# EAGLE design Adafruit CAP1188 (EAGLE 6.3)
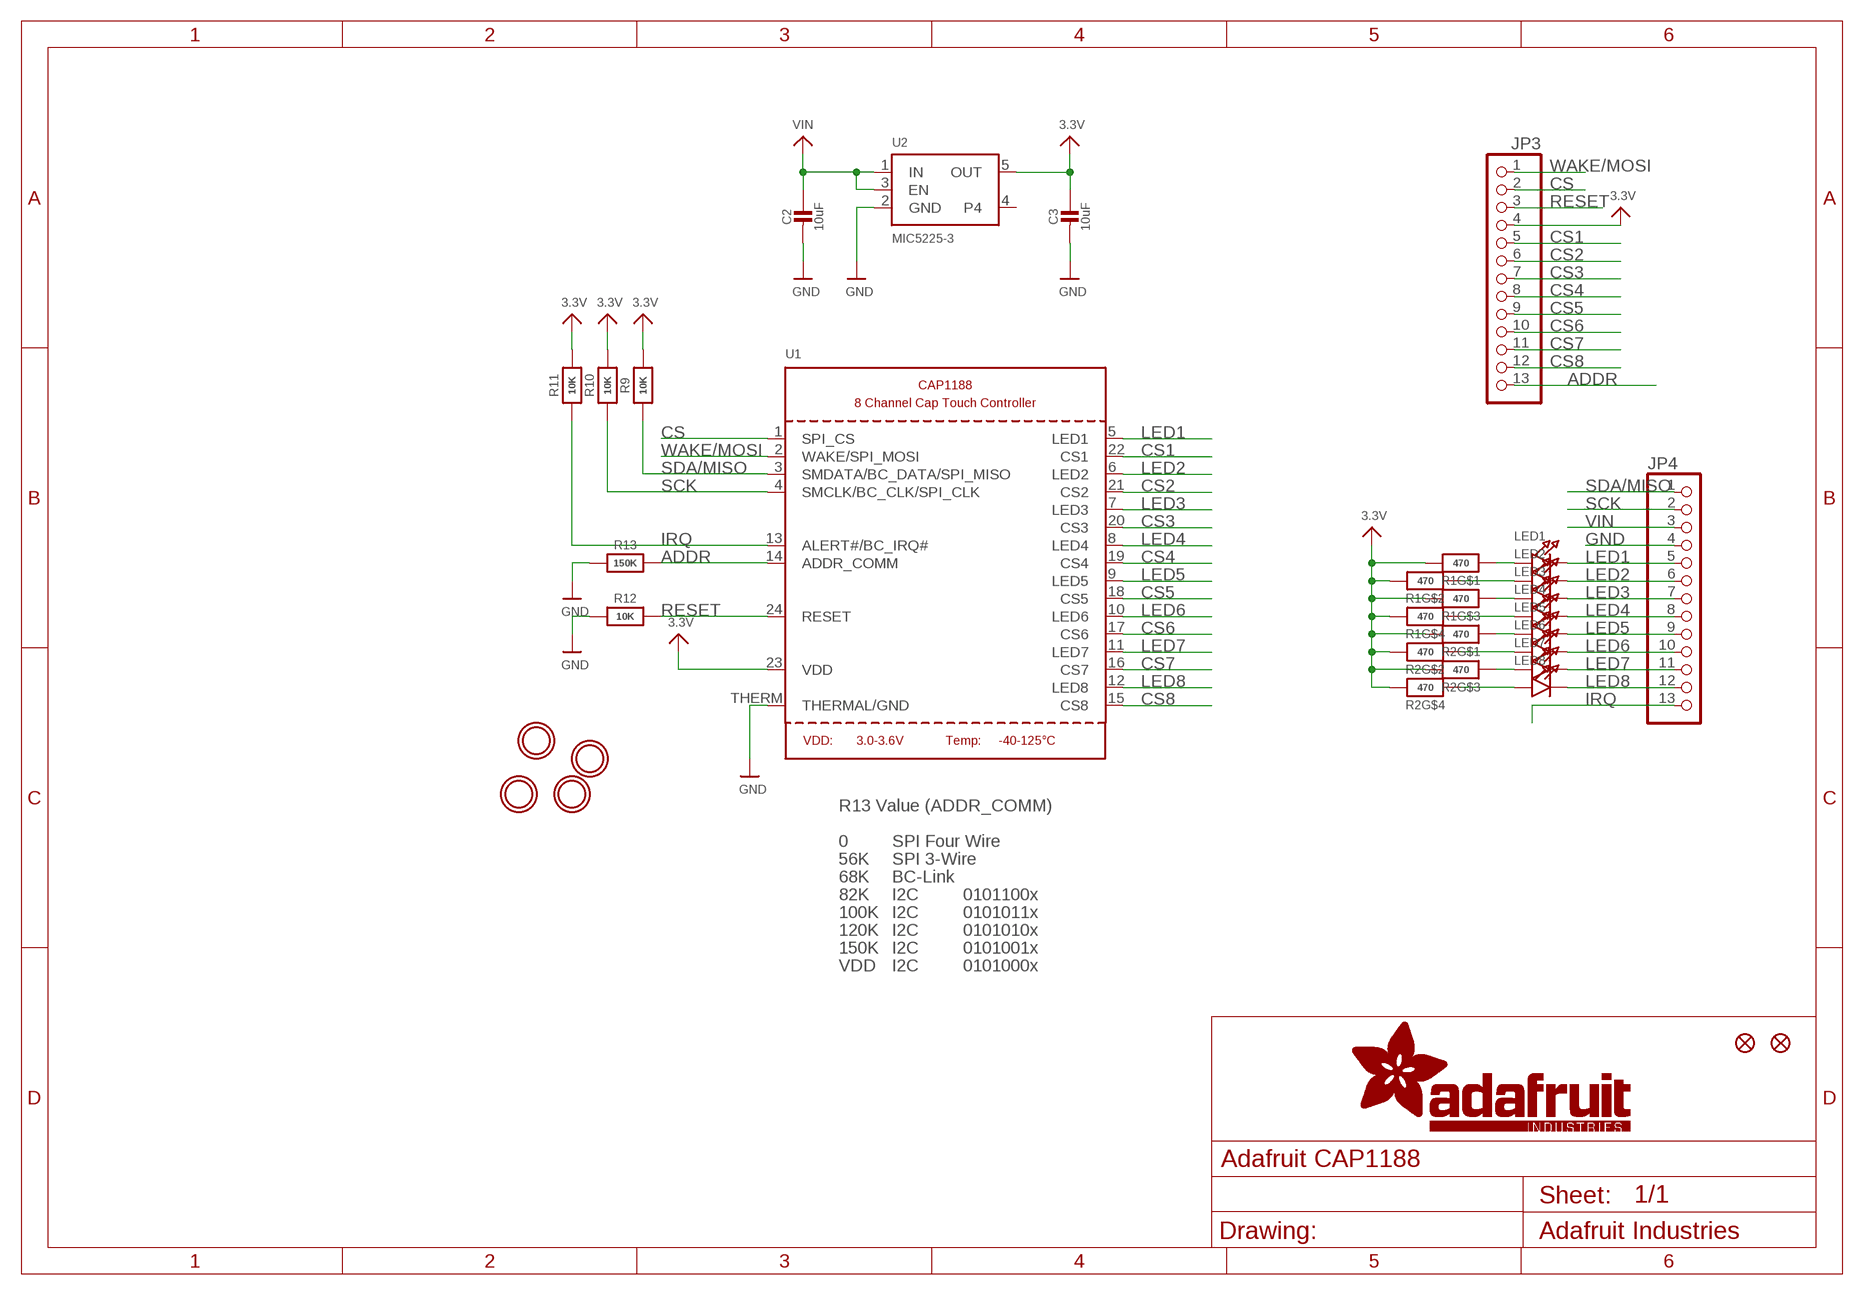
[diagram p0: schematic, sheet 1]

## Parts
C2  10uF  CAP_CERAMIC0805-NOOUTLINE  [0805-NO]
C3  10uF  CAP_CERAMIC0805-NOOUTLINE  [0805-NO]
FID1  FIDUCIAL""  [FIDUCIAL_1MM]
FID2  FIDUCIAL""  [FIDUCIAL_1MM]
JP3  HEADER-1X13  [1X13_ROUND_70]
JP4  HEADER-1X13  [1X13_ROUND_70]
LED1  LED0805  [CHIPLED_0805]
LED2  LED0805  [CHIPLED_0805]
LED3  LED0805  [CHIPLED_0805]
LED4  LED0805  [CHIPLED_0805]
LED5  LED0805  [CHIPLED_0805]
LED6  LED0805  [CHIPLED_0805]
LED7  LED0805  [CHIPLED_0805]
LED8  LED0805  [CHIPLED_0805]
R1  470  RESISTOR_4PACK  [RESPACK_4X0603]
R2  470  RESISTOR_4PACK  [RESPACK_4X0603]
R9  10K  RESISTOR0805_NOOUTLINE  [0805-NO]
R10  10K  RESISTOR0805_NOOUTLINE  [0805-NO]
R11  10K  RESISTOR0805_NOOUTLINE  [0805-NO]
R12  10K  RESISTOR0805_NOOUTLINE  [0805-NO]
R13  150K  RESISTOR_0805MP  [_0805MP]
U1  CAP1188  [QFN24_4MM_SMSC]
U2  MIC5225-3  VREG_SOT23-5  [SOT23-5]
U$7  MOUNTINGHOLE2.0  [MOUNTINGHOLE_2.0_PLATED]
U$8  MOUNTINGHOLE2.0  [MOUNTINGHOLE_2.0_PLATED]
U$9  MOUNTINGHOLE2.0  [MOUNTINGHOLE_2.0_PLATED]
U$10  MOUNTINGHOLE2.0  [MOUNTINGHOLE_2.0_PLATED]

## Nets
3.3V: C3.1 JP3.4 R1.5 R1.6 R1.7 R1.8 R2.5 R2.6 R2.7 R2.8 R9.2 R10.2 R11.2 U1.23(VDD) U2.5(OUT)
ADDR: JP3.13 R13.2 U1.14(ADDR_COMM)
CS: JP3.2 U1.1(SPI_CS)
CS1: JP3.5 U1.22(CS1)
CS2: JP3.6 U1.21(CS2)
CS3: JP3.7 U1.20(CS3)
CS4: JP3.8 U1.19(CS4)
CS5: JP3.9 U1.18(CS5)
CS6: JP3.10 U1.17(CS6)
CS7: JP3.11 U1.16(CS7)
CS8: JP3.12 U1.15(CS8)
GND: C2.2 C3.2 JP4.4 R12.1 R13.1 U1.THERM(THERMAL/GND) U2.2(GND)
IRQ: JP4.13 R11.1 U1.13(ALERT#/BC_IRQ#)
LED1: JP4.5 LED1.C U1.5(LED1)
LED2: JP4.6 LED2.C U1.6(LED2)
LED3: JP4.7 LED3.C U1.7(LED3)
LED4: JP4.8 LED4.C U1.8(LED4)
LED5: JP4.9 LED5.C U1.9(LED5)
LED6: JP4.10 LED6.C U1.10(LED6)
LED7: JP4.11 LED7.C U1.11(LED7)
LED8: JP4.12 LED8.C U1.12(LED8)
N$1: LED1.A R1.1
N$2: LED2.A R1.2
N$3: LED3.A R1.3
N$4: LED4.A R1.4
N$5: LED5.A R2.1
N$6: LED6.A R2.2
N$7: LED7.A R2.3
N$8: LED8.A R2.4
RESET: JP3.3 R12.2 U1.24(RESET)
SCK: JP4.2 R10.1 U1.4(SMCLK/BC_CLK/SPI_CLK)
SDA/MISO: JP4.1 R9.1 U1.3(SMDATA/BC_DATA/SPI_MISO)
VIN: C2.1 JP4.3 U2.1(IN) U2.3(EN)
WAKE/MOSI: JP3.1 U1.2(WAKE/SPI_MOSI)
Unconnected: U2.4

## Notes on the sheet
- R13 Value (ADDR_COMM)
- 0 | SPI Four Wire
- 56K | SPI 3-Wire
- 68K | BC-Link
- 82K | I2C | 0101100x
- 100K | I2C | 0101011x
- 120K | I2C | 0101010x
- 150K | I2C | 0101001x
- VDD | I2C | 0101000x

## Library data of the parts
C2 C3 = microbuilder:CAP_CERAMIC: Ceramic Capacitors For new designs, use the packages preceded by an '_' character since they are more reliable: The following footprints should be used on most boards: _0402 - Standard footprint for regular board layouts _0603 - Standard footprint for regular board layouts _0805 - Standard footprint for regular board layouts _1206 - Standard footprint for regular board layouts For extremely tight-pitch boards where space is at a premium, the following 'micro-pitch' footprints can be used (smaller pads, no silkscreen outline, etc.): _0402MP - Micro-pitch footprint for very dense/compact boards _0603MP - Micro-pitch footprint for very dense/compact boards _0805MP - Micro-pitch footprint for very dense/compact boards _1206MP - Micro-pitch footprint for very dense/compact boards
FID1 FID2 = microbuilder:FIDUCIAL: Fiducial Alignment Points Various fiducial points for machine vision alignment.; BOM: EXCLUDE
JP3 JP4 = microbuilder:HEADER-1X13
LED1-LED8 = microbuilder:LED: LED 0603 - 0603 Surface Mount Package 2mA: Green LED - Low Power (3.9mcd, 2ma, 1.7Vf) - Digikey: 475-2709-2-ND Orange LED - Low Power (9.8mcd, 2ma, 1.8Vf) - Digikey: 475-1194-2-ND Red LED - Low Power (5mcd, 2ma, 1.8Vf) - Digikey: 475-1195-2-ND Yellow LED - Low Power (7mcd, 2ma, 1.8Vf) - Digikey: 475-1196-2-ND 5mA: Blue LED - Low Power (17mcd, 5ma, 2.9Vf) - Digikey: LNJ937W8CRACT-ND 0805 - 0805 Surface Mount Package 2mA: Red LED (8.8mcd, 2mA, 1.8Vf, Clear) - Low Power [Digikey: 475-2510-1-ND] Green LED (5mcd, 2mA, 1.8Vf, Clear) - Low Power [Digikey: 475-2730-1-ND] Yellow LED (11.3mcd, 2mA, 1.8Vf, Clear) - Low Power [Digikey: 475-2555-1-ND] 20mA: Red LED (104mcd, 20mA, Diffused) - LS R976 [Digikey: 475-1278-6-ND] Red LED (12mcd, 20mA, 2.0Vf, Clear) - APT2012EC [Digikey: 754-1128-1-ND] Green LED (15mcd, 20mA, 2.2Vf, Clear) - APT2012GC [Digikey: 754-1131-1-ND] Orange LED (160mcd, 20mA, 2.1Vf, Clear) - APT2012SECK [Digikey: 754-1130-1-ND] 1206 - 1206 Surface Mount Package Green LED (26mcd, 20mA, Diffused) - LG N971 [Digikey: 475-1407-6-ND] Red LED (15mcd, 20mA, Diffused) - LH N974 [Digikey: 475-1416-6-ND] Cree - Cree High-Power Surface Mount LEDs XPEBWT-L1-0000-00D50 - White 111lm 350mA 2.9Vf 6200K 110° XTEAWT-00-0000-00000LEE3 - White 114lm 350mA 2.85Vf 5000K 115° Everlight - Everlight 45-21 Series Surface Mount LEDs 45-21/QK2C-B2832AC2CB2/2T - Warm White 2000mcd 20mA 3.25Vf 3050K 120° 45-21/LK2C-B38452C4CB2/2T - Nuetral White 2000mcd 20mA 3.25Vf 4150K 120° 45-21/LK2C-B50634C6CB2/2T - Cold White 2200mcd 20mA 3.25Vf 5650K 120° PLCC2 Reverse Mount LS T77K-J1L2-1-0-2-R18-Z - Red 11.25mcd 2mA 1.8Vf 630nm 120° LO T77K-L1M2-24-Z - Orange 19.6mcd 2mA 1.8Vf 606nm 120° LY T77K-K2M1-26-Z - Yellow 15.7mcd 2mA 1.8Vf 587nm 120°
R1 R2 = microbuilder:RESISTOR_4PACK: Resistor Packs (4 resistors) 4 x 0603 10K 1/16W - Digikey: YC164J-10KCT-ND
R9-R13 = microbuilder:RESISTOR: Resistors For new designs, use the packages preceded by an '_' character since they are more reliable: The following footprints should be used on most boards: _0402 - Standard footprint for regular board layouts _0603 - Standard footprint for regular board layouts _0805 - Standard footprint for regular board layouts _1206 - Standard footprint for regular board layouts For extremely tight-pitch boards where space is at a premium, the following 'micro-pitch' footprints can be used (smaller pads, no silkscreen outline, etc.): _0402MP - Micro-pitch footprint for very dense/compact boards _0603MP - Micro-pitch footprint for very dense/compact boards _0805MP - Micro-pitch footprint for very dense/compact boards _1206MP - Micro-pitch footprint for very dense/compact boards
U1 = microbuilder:CAP1188: CAP1188 - Eight Channel Cap Touch Controller
U2 = microbuilder:VREG_SOT23-5: SOT23-5 Fixed Voltage Regulators Part Current Out V Out V In V Dropout θJA (°C/W) TJ (°C) Digikey Part No. ADP121 150mA 3.3V 3.4-5.5V 0.09V @ 150mA -- -- ADP121-AUJZ33R7CT-ND ADP121 150mA 3.0V 3.1-5.5V 0.09V @ 150mA -- -- ADP121-AUJZ30R7CT-ND ADP122 300mA 3.3V 3.4-5.5V 0.085V @ 300mA -- -- ADP122AUJZ-3.3-R7CT-ND ADP1712 300mA 3.3V 3.5-5.5V 0.17V @ 300mA -- -- ADP1712AUJZ-3.3-R7TR-ND AP7311 (Low Cost) 150mA 3.3V 3.5-6V 0.15V @ 150mA -- -- AP7311-33WG-7DICT-ND LD39015M18R 150mA 1.8V 1.9V-5.5V 0.08V @ 100mA -- -- 497-6977-1-ND LP2985A-33DBVR 150mA 3.3V 3.3-16V 0.28V @ 150mA 206 150 296-18479-1-ND MCP1824T-3302E/OT 300mA 3.3V 3.5V-6V 0.2V @ 300mA -- -- MCP1824T-3302E/OTCT-ND MIC5205-2.5YM5 TR 150mA 2.5V 2.7-16V 0.165V @ 150mA -- -- 576-1257-2-ND MIC5205-3.0YM5 TR 150mA 3.0V 3.2V-16V 0.165V @ 150mA -- -- 576-1258-2-ND MIC5205-3.3YM5 TR 150mA 3.3V 3.5V-16V 0.165V @ 150mA -- -- 576-1259-2-ND TPS780330220 150mA 3.3V+2.2V 3.6-5.5V 250mV Max -- -- 296-23332-1-ND TDA3663/N1,135 100mA 3.3V 3.5-45V 0.18V @ 50mA -- -- 568-5343-1-ND Max operating temp can be calculated using θJA, TJ (max junction temperature), and power in watts. Set the "Maximum Ambient Temperature" until it reaches TJ ("Max Junction Temperature"), which is the absolute limit for safe use of the regulator: Heat Sink Temperature Calculator <http://www.daycounter.com/Calculators/Heat-Sink-Temperature-Calculator.phtml> For example, With 12V source into a 3.3V LP2985 and a 30mA load, we are dissipating (12V-3.3V) * 0.03A = 0.261W. With a θJA of 206 °C/W, a TJ of 150°C, and 261mW we can safely use the chip without a heat sink up to 75°C (=147.1°C Junction Temperature).
U$7-U$10 = microbuilder:MOUNTINGHOLE: Mounting Hole For #2 screws (0.086"/2.18mm width, 0.094"/2.4mm hole) use 2.5mm; BOM: EXCLUDE

## Board
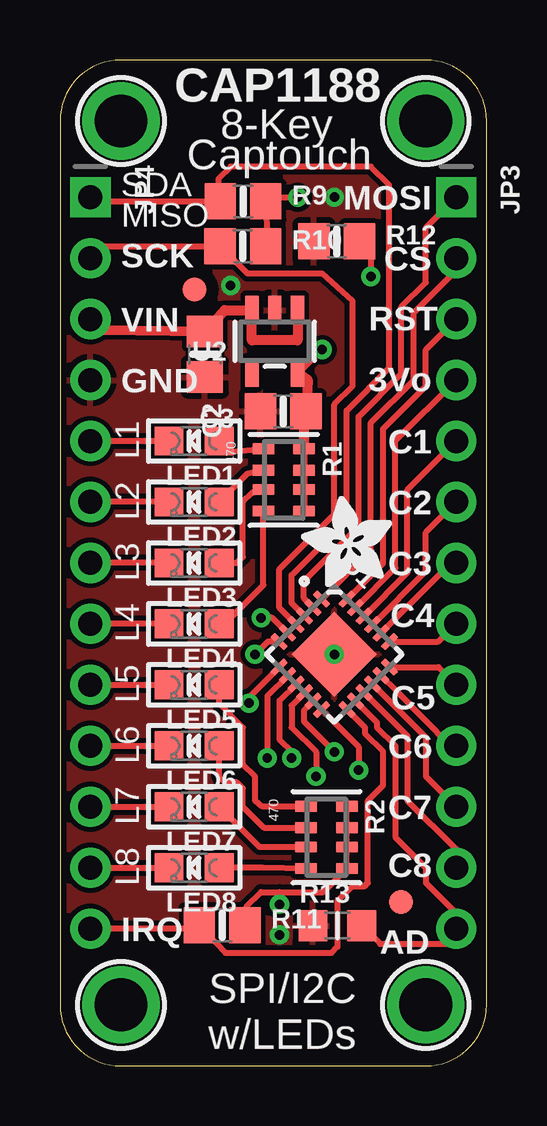
[diagram p1: board, top side]
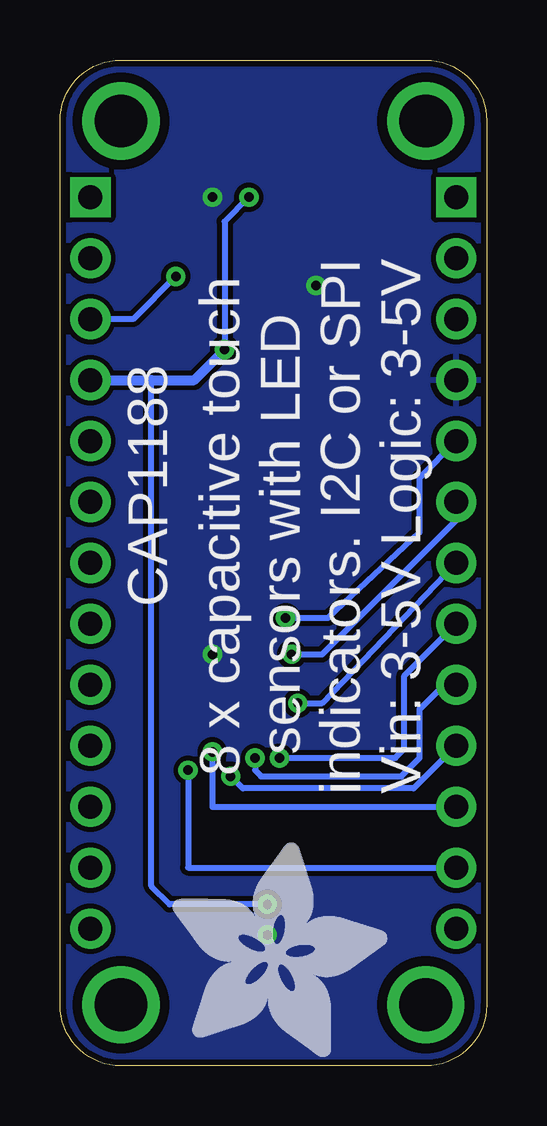
[diagram p2: board, bottom side, seen from below]

Size 17.78 x 41.91 mm. Coordinates in mm from the lower left corner, seen from the top.
Outline: 0,39.37 0,2.54 arc90 2.54,0 15.24,0 arc90 17.78,2.54 17.78,39.37 arc90 15.24,41.91 2.54,41.91 arc90 0,39.37
Copper layers (1*16): Top 0.035mm / dielectric 1.5mm / Bottom 0.035mm
Design rules "adafruit": minimum track width 8mil, minimum drill 15.5mil, track to track 8mil, track to pad 8mil, pad to pad 8mil, via to via 8mil, smd to smd 8mil, copper to edge 10mil, drill to drill 8mil, minimum pad ring 10mil, minimum via ring 8mil, stop-mask expansion 4mil, vias tented up to drill 20mil, thermal gap 10mil

### Footprints (pad centres in the part's own frame; a part is rotated, then mirrored left to right if it is on the bottom)
0805-NO = smd 1.3 x 1.5: 1 -0.95,0; 2 0.95,0
FIDUCIAL_1MM = smd 1 x 1: 1 0,0
1X13_ROUND_70 = drill 1 pad 1.676 square: 1 -15.24,0 | drill 1 pad 1.676: 2 -12.7,0; 3 -10.16,0; 4 -7.62,0; 5 -5.08,0; 6 -2.54,0; 7 0,0; 8 2.54,0; 9 5.08,0; 10 7.62,0; 11 10.16,0; 12 12.7,0; 13 15.24,0
CHIPLED_0805 = smd 1.2 x 1.2: A 0,-1.05; C 0,1.05
RESPACK_4X0603 = smd 0.45 x 0.9: 1 -1.3,-0.85; 2 -0.4,-0.85; 3 0.4,-0.85; 4 1.3,-0.85; 5 1.3,0.85; 6 0.4,0.85; 7 -0.4,0.85; 8 -1.3,0.85
_0805MP = smd 1.2 x 1.3: 1 -1.016,0; 2 1.016,0
QFN24_4MM_SMSC = smd 0.8 x 0.28: 1 -2,1.25; 2 -2,0.75; 3 -2,0.25; 4 -2,-0.25; 5 -2,-0.75; 6 -2,-1.25; 13 2,-1.25; 14 2,-0.75; 15 2,-0.25; 16 2,0.25; 17 2,0.75; 18 2,1.25 | smd 0.28 x 0.8: 7 -1.25,-2; 8 -0.75,-2; 9 -0.25,-2; 10 0.25,-2; 11 0.75,-2; 12 1.25,-2; 19 1.25,2; 20 0.75,2; 21 0.25,2; 22 -0.25,2; 23 -0.75,2; 24 -1.25,2 | smd 2.5 x 2.5: THERM 0,0
SOT23-5 = smd 0.55 x 1.2: 1 -0.95,-1.3; 2 0,-1.3; 3 0.95,-1.3; 4 0.95,1.3; 5 -0.95,1.3
MOUNTINGHOLE_2.0_PLATED = drill 2.2 pad 3: P$1 0,0

### Placement (x,y rotation side)
C2  6.04,29.65 270 top
C3  9.3,27.27 180 top
FID1  14.22,6.82 90 top
FID2  5.61,32.34 90 top
JP3  16.51,20.95 270 top
JP4  1.27,20.95 270 top
LED1  5.59,26.04 90 top
LED2  5.59,23.5 90 top
LED3  5.59,20.95 90 top
LED4  5.59,18.41 90 top
LED5  5.59,15.88 90 top
LED6  5.59,13.34 90 top
LED7  5.59,10.79 90 top
LED8  5.59,8.26 90 top
R1  9.32,24.42 270 top
R2  11.1,9.52 270 top
R9  7.63,36.02 0 top
R10  7.62,34.15 0 top
R11  6.76,5.86 0 top
R12  11.53,34.35 0 top
R13  11.56,5.84 0 top
U1  11.43,17.14 315 top
U2  8.95,30.19 180 top
U$7  2.54,2.54 0 top
U$8  15.24,2.54 0 top
U$9  2.54,39.37 0 top
U$10  15.24,39.37 0 top
U$13  [ADAFRUIT_3.5MM]  13.84,19.94 90 top
U$14  [ADAFRUIT_9MM]  13.08,0.38 0 bottom

### Tracks (layer width: path | path; a pad name or v marks a point on that pad's centre or on a via)
3.3V  (via drill 0.39)
  Top 0.254: U1.23 13.97,20.75 13.97,26.04 JP3.4 | R11.2 7.76,6.62 8.38,7.24 9.14,7.24 | 9.14,7.24 10.97,7.24 R2.5 R2.6 R2.7 R2.8 | R1.8 R1.7 R1.6 R1.5 | R10.2 8.64,34.35 R9.2 8.72,36.2 v9.91,36.2 | v10.92,29.84 10.1,29.02 U2.5 | 9.14,7.24 v9.14,6.73
  Top 0.406: U2.5 10.32,28.59 C3.1 10.17,27.4 R1.8
  Bottom 0.254: v9.91,36.2 10.92,35.18 v10.92,29.84 | v9.14,6.73 13.21,6.73 13.97,7.49 13.97,28.57
  Bottom 0.406: JP3.4 13.97,28.57 12.19,28.57 v10.92,29.84
ADDR
  Top 0.254: U1.14 13.21,14.31 13.21,14.1 13.97,13.34 13.97,9.53 15.24,8.26 15.24,7.62 16.51,6.35 JP3.13 16.51,5.33 16.26,5.08 13.34,5.08 R13.2
CS
  Top 0.254: U1.1 12.95,21.5 12.95,26.8 14.73,28.57 14.73,31.37 16.51,33.15 JP3.2
CS1
  Top 0.254: JP3.5 14.48,24 14.48,20.55 U1.22
CS2
  Top 0.254: JP3.6 15.24,22.23 15.24,20.6 U1.21
CS3
  Top 0.254: U1.20 16.3,20.95 JP3.7
CS4
  Top 0.254: U1.19 15.77,17.68 JP3.8
CS5
  Top 0.254: U1.18 15.77,16.61 JP3.9
CS6
  Top 0.254: U1.17 14.02,15.62 16.26,13.34 JP3.10
CS7
  Top 0.254: U1.16 15.24,13.69 15.24,12.06 JP3.11
CS8
  Top 0.254: U1.15 14.48,13.74 14.48,11.05 16.51,9.02 JP3.12
GND  (via drill 0.39)
  other vias: 7.11,32.51 11.43,17.14 9.14,5.46 11.43,36.2
  pour Top: 0,41.97 17.72,41.97 17.72,-0.13 0,-0.13
  pour Bottom: 0,41.97 17.98,41.97 17.85,-0.13 -0.13,-0.13
IRQ
  Top 0.254: JP4.13 5.85,5.71 R11.1 6.9,4.7 11.3,4.7 11.56,4.95 11.56,6.86 12.19,7.49 12.7,7.49 12.83,7.62 12.83,11.05 13.46,11.68 13.46,13.08 12.7,13.84 12.7,14.11 U1.13
LED1  (via drill 0.39)
  Top 0.254: JP4.5 LED1.C | U1.5 8.85,18.67 v8.38,18.67
  Bottom 0.254: v8.38,18.67 6.6,18.67 2.79,22.23 2.79,24.51 JP4.5
LED2  (via drill 0.39)
  Top 0.254: LED2.C JP4.6 | U1.6 8.66,17.68 v8.13,17.14
  Bottom 0.254: v8.13,17.14 6.86,17.14 1.27,22.73 JP4.6
LED3  (via drill 0.39)
  Top 0.254: LED3.C JP4.7 | U1.7 7.88,15.37 v7.87,15.11
  Bottom 0.254: v7.87,15.11 6.86,15.11 JP4.7
LED4  (via drill 0.39)
  Top 0.254: LED4.C JP4.8 | U1.8 8.64,15.41 v8.64,12.83
  Bottom 0.254: JP4.8 3.43,16.26 3.43,13.21 3.81,12.83 v8.64,12.83
LED5  (via drill 0.39)
  Top 0.254: JP4.9 LED5.C | U1.9 9.14,15.21 9.14,13.59 9.65,13.08 v9.65,12.83
  Bottom 0.254: v9.65,12.83 9.65,12.32 9.4,12.06 3.56,12.06 2.79,12.83 2.79,14.86 1.78,15.88 JP4.9
LED6  (via drill 0.39)
  Top 0.254: JP4.10 LED6.C | U1.10 9.65,15.01 9.65,14.1 10.67,13.08 v10.67,12.06
  Bottom 0.254: JP4.10 3.05,11.56 10.16,11.56 v10.67,12.06
LED7  (via drill 0.39)
  Top 0.254: JP4.11 LED7.C | U1.11 10.16,14.81 10.16,14.35 v11.43,13.08
  Bottom 0.254: JP4.11 11.43,10.79 v11.43,13.08
LED8  (via drill 0.39)
  Top 0.254: JP4.12 LED8.C | U1.12 12.45,13.3 v12.45,12.32
  Bottom 0.254: JP4.12 12.45,8.26 v12.45,12.32
N$1
  Top 0.254: LED1.A 7.08,25.59 R1.1
N$2
  Top 0.254: LED2.A 7.83,24.69 R1.2
N$3
  Top 0.254: LED3.A 7.37,20.95 7.62,21.21 7.62,23.5 8.01,23.89 R1.3
N$4
  Top 0.254: LED4.A 6.86,18.41 8.47,20.03 R1.4
N$5
  Top 0.254: R2.1 8.41,10.82 8.13,11.05 8.13,12.06 7.62,12.57 7.62,14.1 6.64,15.08 LED5.A
N$6
  Top 0.254: R2.2 8.49,9.92 7.62,10.79 7.62,11.56 7.37,11.81 6.86,11.81 6.64,12.03 LED6.A
N$7
  Top 0.254: LED7.A 8.31,9.12 R2.3
N$8
  Top 0.254: R2.4 8.44,8.26 LED8.A
RESET  (via drill 0.39)
  Top 0.254: U1.24 13.46,20.95 13.46,26.54 15.24,28.32 15.24,29.84 JP3.3 | R12.2 12.95,33.95 v12.95,32.89
  Bottom 0.254: v12.95,32.89 14.73,31.11 JP3.3
SCK
  Top 0.254: U1.4 9.14,19.08 9.14,20.7 11.43,22.99 11.43,27.56 12.19,28.32 12.19,31.88 10.92,33.02 7.81,33.02 R10.1 1.79,34.15 JP4.2
SDA/MISO
  Top 0.254: U1.3 9.65,19.28 9.65,20.45 11.94,22.73 11.94,27.3 13.72,29.08 13.72,36.7 12.95,37.47 7.11,37.47 6.6,36.96 6.6,36.27 R9.1 1.47,36.02 JP4.1
VIN
  Top 0.406: JP4.3 1.72,30.67 C2.1 6.86,31.49 U2.3 8,30.23 9.9,30.23 U2.1
WAKE/MOSI
  Top 0.254: U1.2 10.16,19.48 10.16,20.19 12.45,22.48 12.45,27.05 14.22,28.83 14.22,31.62 15.24,32.64 15.24,34.92 JP3.1 16.26,36.2

### Text on the board
tPlace: CAP1188 | 8-Key | Captouch | SDA | MOSI | MISO | SCK | CS | VIN | RST | GND | 3Vo | C1 | L1 | L2 | C2 | C3 | L3 | C4 | L4 | L5 | C5 | L6 | C6 | C7 | L7 | C8 | L8 | IRQ | AD | SPI/I2C / w/LEDs
bPlace: CAP1188 | 8 x capacitive touch / sensors with LED / indicators. I2C or SPI / Vin: 3-5V Logic: 3-5V